# Altium schematic sheet AUDIO_DAC.SchDoc
size A4
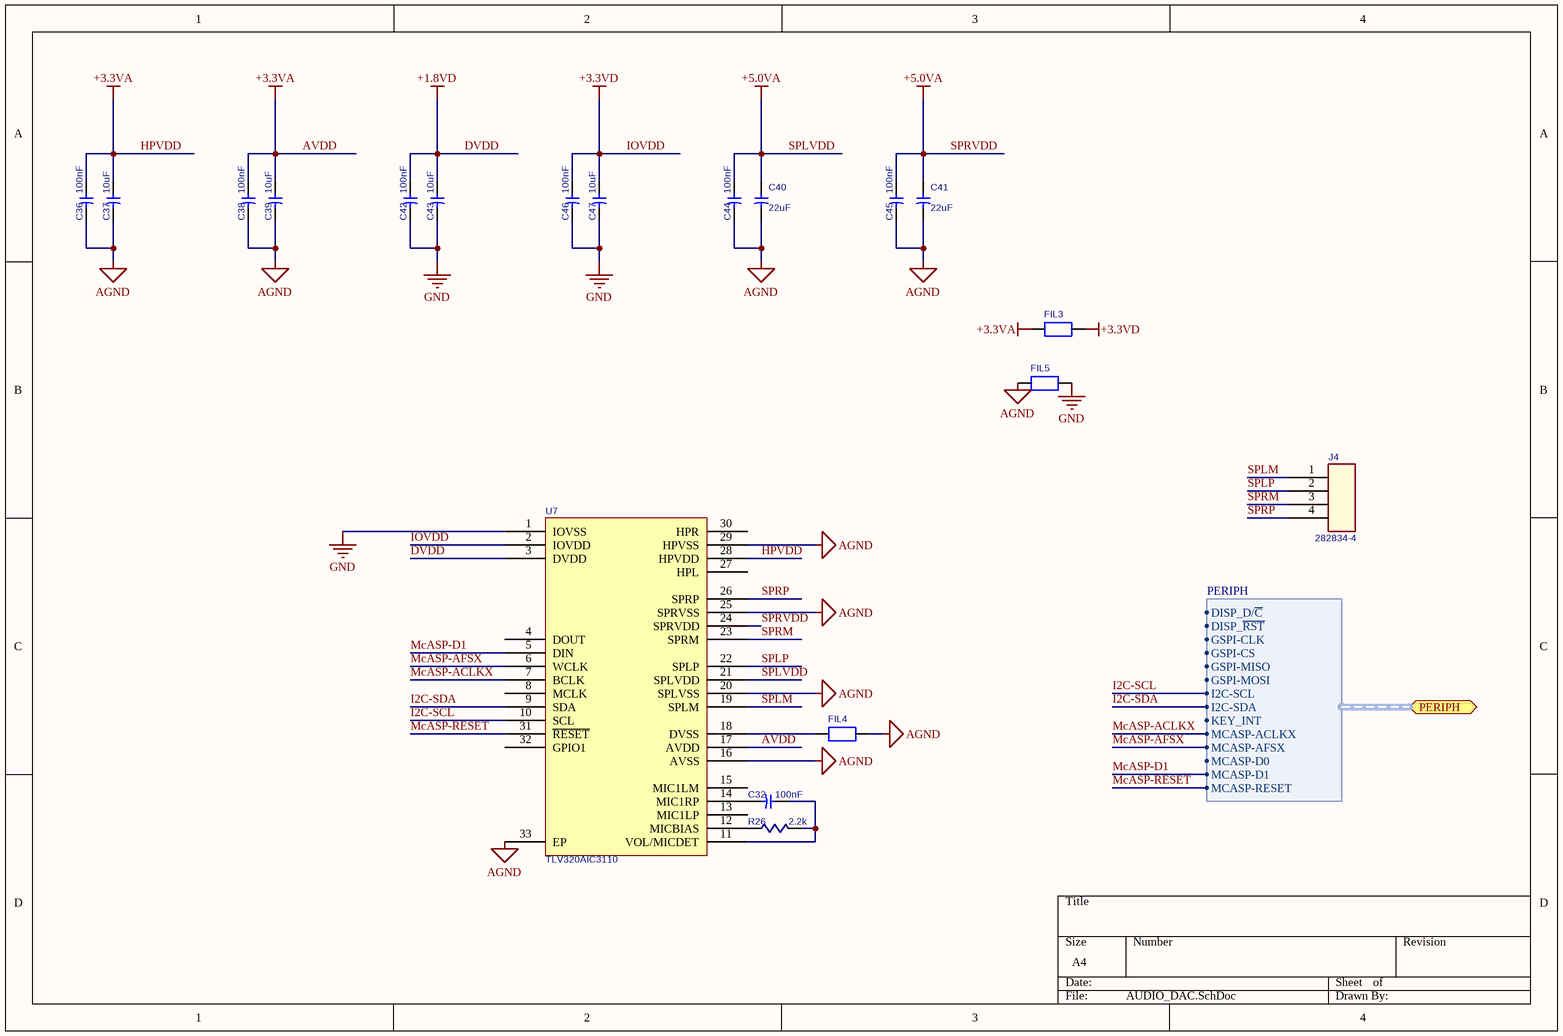
[diagram p0: AUDIO_DAC.SchDoc]

## Parts
C32  100nF  [C_0603A]
C36  100nF  [C_0603A]
C37  10uF  [C_0603A]
C38  100nF  [C_0603A]
C39  10uF  [C_0603A]
C40  22uF  [C_1210D]
C41  22uF  [C_1210D]
C42  100nF  [C_0603A]
C43  10uF  [C_0603A]
C44  100nF  [C_0603A]
C45  100nF  [C_0603A]
C46  100nF  [C_0603A]
C47  10uF  [C_0603A]
FIL3  FB  [FB_0603]  (value not drawn)
FIL4  FB  [FB_0603]  (value not drawn)
FIL5  FB  [FB_0603]  (value not drawn)
J4  282834-4  [HEADER_2.54_SCREW_4PIN]
R26  2.2k  [R_0603]
U7  TLV320AIC3110  [QFN50P500X500X80-32N]

## Ports
PERIPH (harness PERIPH)

## Harnesses
PERIPH: DISP_D/~{C}, DISP_~{RST}, GSPI-CLK, GSPI-CS, GSPI-MISO, GSPI-MOSI, I2C-SCL, I2C-SDA, KEY_INT, MCASP-ACLKX, MCASP-AFSX, MCASP-D0, MCASP-D1, MCASP-RESET

## Nets
AGND: C36.2 C37.2 C38.2 C39.2 C40.2 C41.2 C44.2 C45.2 FIL4.1 FIL5.2 U7.16(AVSS) U7.20(SPLVSS) U7.25(SPRVSS) U7.29(HPVSS) U7.33(EP)
AVDD: C36.1 C37.1 C38.1 C39.1 FIL3.2 U7.17(AVDD) U7.28(HPVDD)  [also labelled +3.3VA, HPVDD]
DVDD: C42.1 C43.1 U7.3(DVDD)  [also labelled +1.8VD]
GND: C42.2 C43.2 C46.2 C47.2 FIL5.1 U7.1(IOVSS)
IOVDD: C46.1 C47.1 FIL3.1 U7.2(IOVDD)  [also labelled +3.3VD]
SPLVDD: C40.1 C41.1 C44.1 C45.1 U7.21(SPLVDD) U7.24(SPRVDD)  [also labelled +5.0VA, SPRVDD]
I2C-SCL: U7.10(SCL) ; port PERIPH.I2C-SCL
I2C-SDA: U7.9(SDA) ; port PERIPH.I2C-SDA
McASP-ACLKX: U7.7(BCLK) ; port PERIPH.MCASP-ACLKX
McASP-AFSX: U7.6(WCLK) ; port PERIPH.MCASP-AFSX
McASP-D1: U7.5(DIN) ; port PERIPH.MCASP-D1
McASP-RESET: U7.31(~{RESET}) ; port PERIPH.MCASP-RESET
SPLM: J4.1 U7.19(SPLM)
SPLP: J4.2 U7.22(SPLP)
SPRM: J4.3 U7.23(SPRM)
SPRP: J4.4 U7.26(SPRP)
NetC32_1: C32.1 R26.1 U7.11(VOL/MICDET)
NetC32_2: C32.2 U7.14(MIC1RP)
NetFIL4_2: FIL4.2 U7.18(DVSS)
NetR26_2: R26.2 U7.12(MICBIAS)

Not connected (* = marked no-connect by the designer): U7 4(DOUT) 8(MCLK) 13(MIC1LP) 15(MIC1LM) 27(HPL) 30(HPR) 32(GPIO1)

## Library data of the parts
C32 C36-C39 C42-C47 = C_0603: PackageReference: C_0603
  C32 C36 C38 C42 C44-C46: VALUE: 100nF
  C37 C39 C43 C47: VALUE: 10uF
C40 C41 = C_1210: PackageReference: C_1210; VALUE: 22uF
FIL3-FIL5 = FB_0603: Manufacturer Part Number: MPZ1608S221ATA00; Manufacturer: TDK Corporation; Current Rating: 2.2A; Impedance: 220 Ohm; DC Resistance (DCR) (Max): 50 mOhm; Filter Type: Power Line; Number of Lines: 1; Impedance @ Frequency: 220 Ohm @ 100MHz; Ratings: -; Package / Case: 0603 (1608 Metric); Part Status: Active; Current Rating (Max): 2.2A; Packaging: Cut Tape (CT); Operating Temperature: -55°C ~ 125°C; Mounting Type: Surface Mount; Height (Max): 0.037" (0.95mm); Size / Dimension: 0.063" L x 0.031" W (1.60mm x 0.80mm); RoHS: RoHS Compliant; Supplier 1: Digi-Key; Category: Filters; ComponentLink1URL: https://product.tdk.com/info/en/catalog/datasheets/beads_commercial_power_mpz1608_en.pdf; ComponentLink1Description: https://product.tdk.com/info/en/catalog/datasheets/beads_commercial_power_mpz1608_en.pdf; Supplier Part Number 1: 445-1565-1-ND
J4 = TERM_LIST_4: Manufacturer: TE CONNECTIVITY / BUCHANAN; Wire Size AWG Min: 30; Rated Voltage: 150; No. of Positions: 4; Connector Type: Terminal Block, Eurostyle; Conductor Area CSA: 1.4; Connector Mounting: PCB Mount; Wire Size AWG Max: 16; Wire Connection Method: Screw; Rated Current: 10; Block Orientation: Through Hole Right Angle; Pitch Spacing: 2.54; Supplier 1: Farnell; Contact Material: Brass; Contact Plating: Tin Plated Contacts<!--FANDB--><div class="features-and-benefits-container"><div class="features-and-benefits-description"><span class="features-benefits-value">The 282834-4 is a 4-position 1-row green through-hole right-angle Terminal Block with tin-plated brass contacts and polyamide 6.6 housing. The BUCHANAN terminal block with special rising cage clamp design allows numerous reliable connections and disconnections at field installations. The housing funnel entry design enables an easier product application.</span></div><div class="features-and-benefits-list"><ul class="features-and-benefits-list-list"><li class="features-and-benefits-list-item">IR Reflow compatible</li><li class="features-and-benefits-list-item">-40 to +105; Manufacturer Part Number: 282834-4; Product Range: -; RoHS: YES; ComponentLink1URL: http://www.farnell.com/cad/1605505.pdf; ComponentLink1Description: http://www.farnell.com/cad/1605505.pdf; ComponentLink2URL: http://www.farnell.com/datasheets/1650926.pdf; ComponentLink2Description: http://www.farnell.com/datasheets/1650926.pdf; ComponentLink3URL: http://www.farnell.com/datasheets/504548.pdf; ComponentLink3Description: http://www.farnell.com/datasheets/504548.pdf; Supplier Part Number 1: 2396253
R26 = R_0603: PackageReference: R_0603; VALUE: 2.2k
U7 = TLV320AIC3110: Manufacturer: Texas Instruments; Manufacturer Part Number: TLV320AIC3110IRHBR; Sigma Delta: Yes; Voltage - Supply, Digital: 1.65 V ~ 1.95 V; Data Interface: I²C, Serial; Voltage - Supply, Analog: 2.7 V ~ 3.6 V; Number of ADCs / DACs: 1 / 2; S/N Ratio, ADCs / DACs (db) Typ: 91 / 95; Resolution (Bits): 32 b; Mounting Type: Surface Mount; Category: Integrated Circuits (ICs); RoHS: RoHS Compliant; Type: Audio; Part Status: Active; Dynamic Range, ADCs / DACs (db) Typ: -; Package / Case: 32-VFQFN Exposed Pad; Supplier Device Package: 32-VQFN (5x5); Packaging: Cut Tape (CT); Supplier 1: Digi-Key; Operating Temperature: -40°C ~ 85°C; ComponentLink1URL: http://www.ti.com/lit/ds/symlink/tlv320aic3110.pdf; ComponentLink1Description: http://www.ti.com/lit/ds/symlink/tlv320aic3110.pdf; Supplier Part Number 1: 296-25584-1-ND